# Altium project Motor_Control_Board.PrjPcb
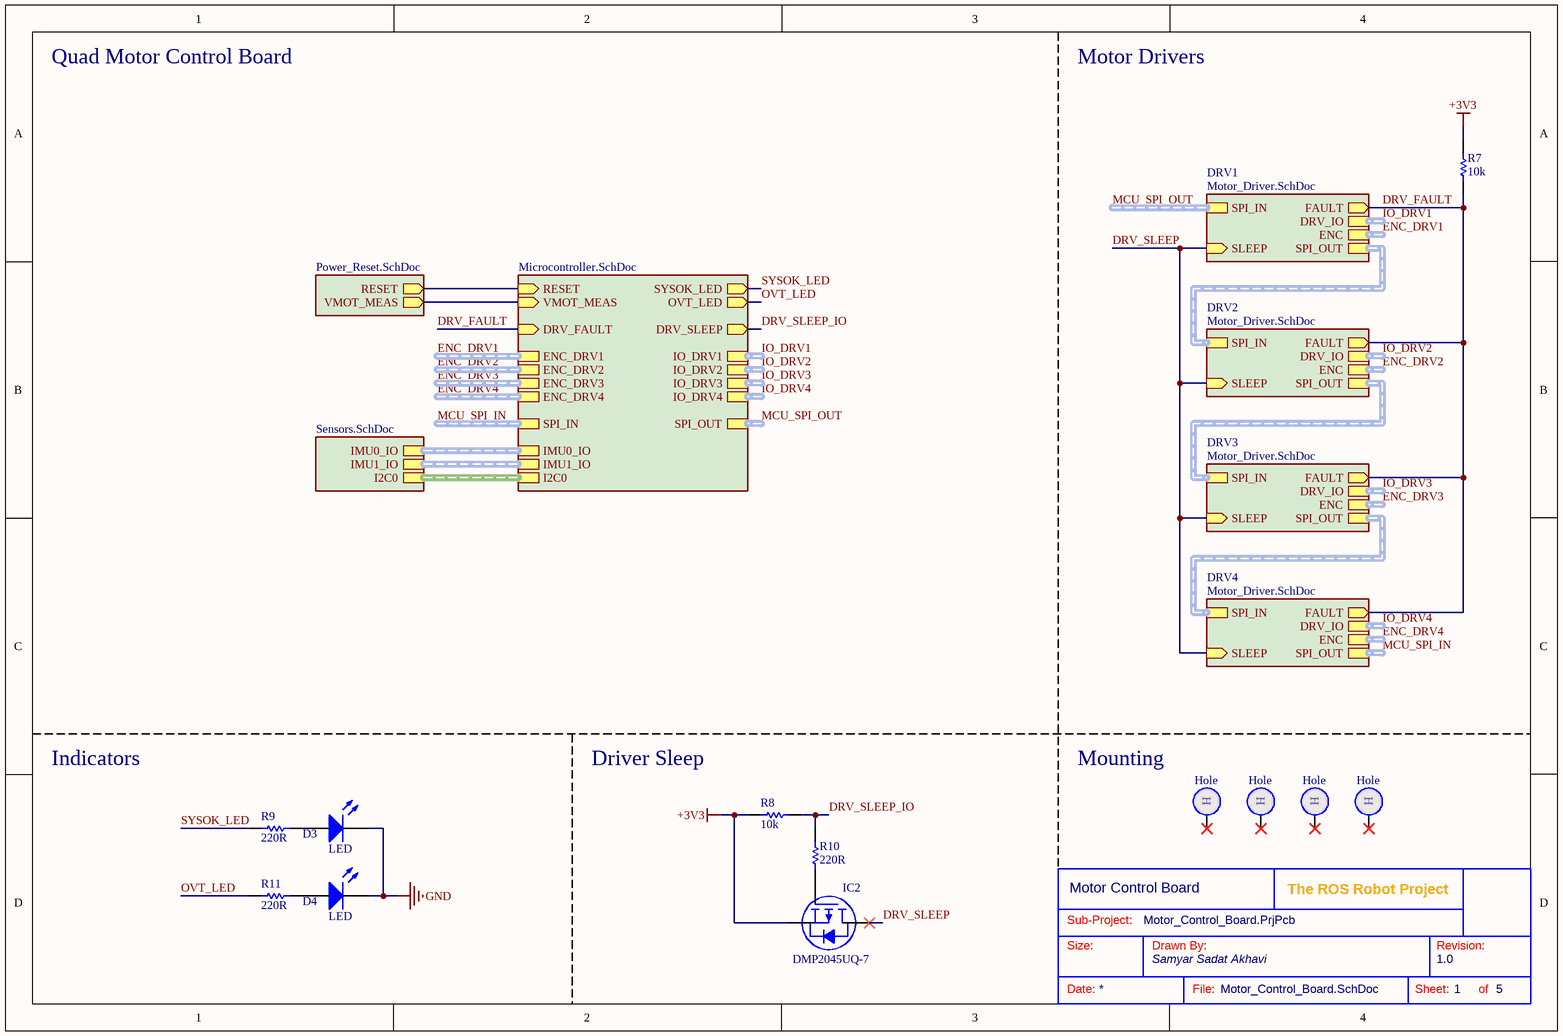
[diagram p0: Motor_Control_Board.SchDoc]
MainProjectName: The ROS Robot Project
4 sheets, 69 parts. Net scope: hierarchical (ports join the sheet entries above them; power ports are global).
Board file: Motor_Control_Board.PcbDoc
Sheets:
  Motor_Control_Board.SchDoc
    MCU = Microcontroller.SchDoc
    PWR = Power_Reset.SchDoc
    SENS = Sensors.SchDoc

## Sheet Motor_Control_Board.SchDoc: Motor Control Board
size A4; DrawnBy: Samyar Sadat Akhavi; Revision: 1.0; SheetNumber: 1; SheetTotal: 5

### Parts
(Parts that share a designator on the sheet are numbered #1, #2 ... from top to bottom, then left to right.)
?#1  (no value)  (graphical)
D3  LED  [LED_1206]
D4  LED  [LED_1206]
Hole1  Hole  [hole_2.6]  (no BOM)
Hole2  Hole  [hole_2.6]  (no BOM)
Hole3  Hole  [hole_2.6]  (no BOM)
Hole4  Hole  [hole_2.6]  (no BOM)
IC2  DMP2045UQ-7  [DIODES SOT-23-3]
R7  10k  [RES_0603]
R8  10k  [RES_0603]
R9  220R  [RES_0603]
R10  220R  [RES_0603]
R11  220R  [RES_0603]

### Sub-sheets
DRV1 = Motor_Driver.SchDoc (file not in this document): DRV_IO (harness Drive_IO), ENC (harness Encoder), SLEEP (in), SPI_IN (harness SPI_Uni), SPI_OUT (harness SPI_Uni), FAULT (out)
DRV2 = Motor_Driver.SchDoc (file not in this document): DRV_IO (harness Drive_IO), ENC (harness Encoder), SLEEP (in), SPI_IN (harness SPI_Uni), SPI_OUT (harness SPI_Uni), FAULT (out)
DRV3 = Motor_Driver.SchDoc (file not in this document): DRV_IO (harness Drive_IO), ENC (harness Encoder), SLEEP (in), SPI_IN (harness SPI_Uni), SPI_OUT (harness SPI_Uni), FAULT (out)
DRV4 = Motor_Driver.SchDoc (file not in this document): DRV_IO (harness Drive_IO), ENC (harness Encoder), SLEEP (in), SPI_IN (harness SPI_Uni), SPI_OUT (harness SPI_Uni), FAULT (out)
MCU = Microcontroller.SchDoc: RESET (in), DRV_SLEEP (out), OVT_LED (out), SYSOK_LED (out), VMOT_MEAS (in), ENC_DRV1 (harness Encoder), IO_DRV1 (harness Drive_IO), SPI_OUT (harness SPI_Uni), SPI_IN (harness SPI_Uni), ENC_DRV2 (harness Encoder), ENC_DRV3 (harness Encoder), ENC_DRV4 (harness Encoder), IO_DRV2 (harness Drive_IO), IO_DRV3 (harness Drive_IO), IO_DRV4 (harness Drive_IO), DRV_FAULT (in), I2C0 (harness I2C), IMU0_IO (harness IMU_IO), IMU1_IO (harness IMU_IO)
PWR = Power_Reset.SchDoc: RESET (out), VMOT_MEAS (out)
SENS = Sensors.SchDoc: I2C0 (harness I2C), IMU0_IO (harness IMU_IO), IMU1_IO (harness IMU_IO)

### Nets
+3V3: IC2.2(S) R7.1 R8.2
GND: D3.2(K) D4.2(K)
DRV_FAULT: R7.2 ; sheet DRV1/FAULT, sheet MCU/DRV_FAULT, sheet DRV2/FAULT, sheet DRV3/FAULT, sheet DRV4/FAULT
DRV_SLEEP: IC2.3(D) ; sheet DRV1/SLEEP, sheet DRV2/SLEEP, sheet DRV3/SLEEP, sheet DRV4/SLEEP
DRV_SLEEP_IO: R8.1 R10.2 ; sheet MCU/DRV_SLEEP
OVT_LED: R11.2 ; sheet MCU/OVT_LED
RESET: sheet MCU/RESET, sheet PWR/RESET
SYSOK_LED: R9.2 ; sheet MCU/SYSOK_LED
VMOT_MEAS: sheet MCU/VMOT_MEAS, sheet PWR/VMOT_MEAS
NetD3_1: D3.1(A) R9.1
NetD4_1: D4.1(A) R11.1
NetIC2_1: IC2.1(G) R10.1

Not connected (* = marked no-connect by the designer): Hole1 1*; Hole2 1*; Hole3 1*; Hole4 1*

### Buses and harness runs
harness ENC_DRV1 = sheet DRV1/ENC
harness ENC_DRV1 = sheet MCU/ENC_DRV1
harness ENC_DRV2 = sheet DRV2/ENC
harness ENC_DRV2 = sheet MCU/ENC_DRV2
harness ENC_DRV3 = sheet DRV3/ENC
harness ENC_DRV3 = sheet MCU/ENC_DRV3
harness ENC_DRV4 = sheet DRV4/ENC
harness ENC_DRV4 = sheet MCU/ENC_DRV4
harness IO_DRV1 = sheet DRV1/DRV_IO
harness IO_DRV1 = sheet MCU/IO_DRV1
harness IO_DRV2 = sheet DRV2/DRV_IO
harness IO_DRV2 = sheet MCU/IO_DRV2
harness IO_DRV3 = sheet DRV3/DRV_IO
harness IO_DRV3 = sheet MCU/IO_DRV3
harness IO_DRV4 = sheet DRV4/DRV_IO
harness IO_DRV4 = sheet MCU/IO_DRV4
harness MCU_SPI_IN = sheet DRV4/SPI_OUT
harness MCU_SPI_IN = sheet MCU/SPI_IN
harness MCU_SPI_OUT = sheet DRV1/SPI_IN
harness MCU_SPI_OUT = sheet MCU/SPI_OUT
harness sheet DRV1/SPI_OUT = sheet DRV2/SPI_IN
harness sheet DRV2/SPI_OUT = sheet DRV3/SPI_IN
harness sheet DRV3/SPI_OUT = sheet DRV4/SPI_IN
harness sheet MCU/I2C0 = sheet SENS/I2C0
harness sheet MCU/IMU0_IO = sheet SENS/IMU0_IO
harness sheet MCU/IMU1_IO = sheet SENS/IMU1_IO

### Notes on the sheet
- Quad Motor Control Board
- Motor Drivers
- Indicators
- Driver Sleep
- Mounting
- Sub-Project:
- Size:
- Drawn By:
- Revision:
- Date:
- File:
- Sheet:
- of
- (in symbol Hole) H

### Library data of the parts
?#1 = Standard Title Block
D3 = LED: Indicator LED; Color: Green
D4 = LED: Indicator LED; Color: Amber
IC2 = DMP2045UQ-7: MOSFET P-CH 20V 4.3A SOT23; Manufacturer: Diodes Incorporated; Current - Continuous Drain (Id) @ 25°C: 4.3A (Ta); Drive Voltage (Max Rds On,  Min Rds On): 1.8V, 4.5V; FET Type: P-Channel; Gate Charge (Qg) (Max) @ Vgs: 6.8 nC @ 4.5 V; Input Capacitance (Ciss) (Max) @ Vds: 634 pF @ 10 V; Power Dissipation (Max): 800mW (Ta); Rds On (Max) @ Id, Vgs: 45mOhm @ 4A, 4.5V; Vgs (Max): ±8V; Vgs(th) (Max) @ Id: 1V @ 250µA; Part Number: DMP2045UQ-7; ComponentLink1Description: Datasheet; ComponentLink1URL: https://www.diodes.com/assets/Datasheets/DMP2045UQ.pdf; ComponentLink2Description: DigiKey Link; ComponentLink2URL: https://www.digikey.com/en/products/detail/diodes-incorporated/DMP2045UQ-7/10674156; Drain to Source Voltage (Vdss): 20 V; LastUpdated: 6/3/2024 8:15:19 PM; Lifecycle Status: Active; Minimum Order: 1; Mounting Type: Surface Mount; Operating Temperature: -55°C ~ 150°C (TJ); Package / Case: TO-236-3, SC-59, SOT-23-3; Packaging: TapeAndReel; Part Status: Active; Price: 0.08; Series: -; Supplier 1: DigiKey; Supplier Part Number 1: 31-DMP2045UQ-7CT-ND; Supplier Device Package: SOT-23-3; Technology: MOSFET (Metal Oxide)
R7-R11 = Resistor: Power: 1/8W
  R7 R8: Value: 10k
  R9-R11: Value: 220R

## Sheet Microcontroller.SchDoc: Microcontroller
size A4; DrawnBy: Samyar Sadat Akhavi; Revision: 1.0; SheetNumber: 3; SheetTotal: 5
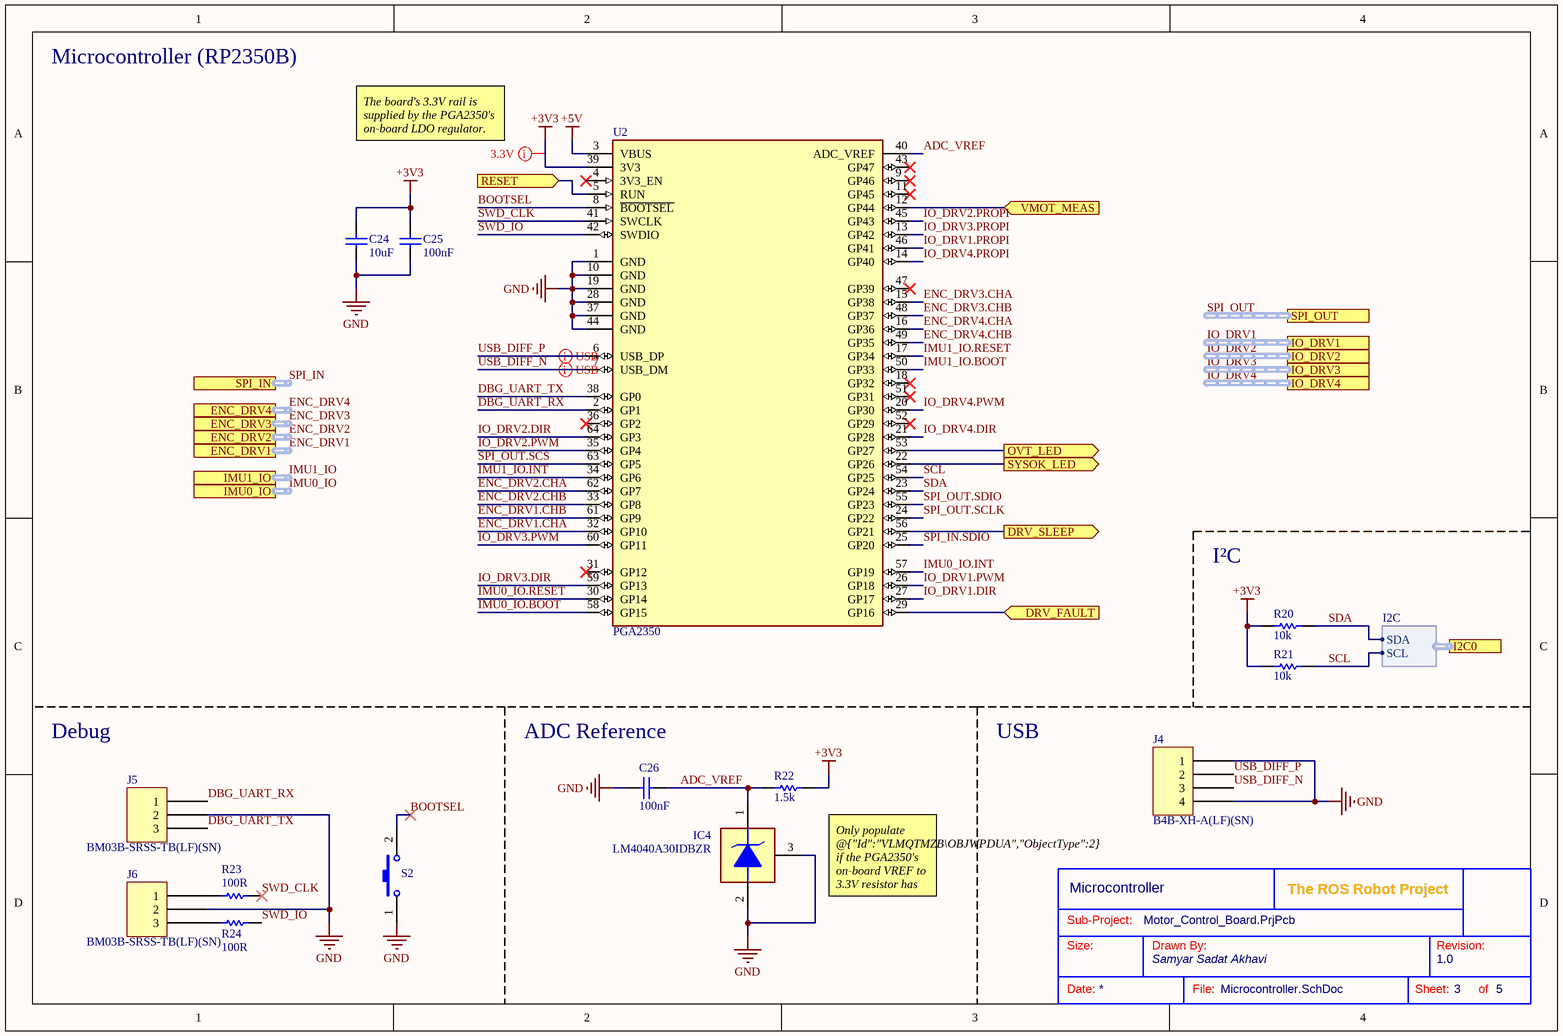
[diagram p1: Microcontroller.SchDoc]

### Parts
(Parts that share a designator on the sheet are numbered #1, #2 ... from top to bottom, then left to right.)
?#2  (no value)  (graphical)
C24  10uF  [CAP_SMD_805]
C25  100nF  [CAP_SMD_603]
C26  100nF  [CAP_SMD_603]
IC4  LM4040A30IDBZR  [SOT95P237X112-3N]
J4  B4B-XH-A(LF)(SN)  [JST XH B4B-XH-A]
J5  BM03B-SRSS-TB(LF)(SN)  [JST BM03B-SRSS-TB]
J6  BM03B-SRSS-TB(LF)(SN)  [JST BM03B-SRSS-TB]
R20  10k  [RES_0603]
R21  10k  [RES_0603]
R22  1.5k  [RES_0603]
R23  100R  [RES_0603]
R24  100R  [RES_0603]
S2  PTS815_SJK_250_SMTR_LFS  [PTS815SJK250SMTRLFS]  (value not drawn)
U2  PGA2350  [PGA2350]

### Ports
DRV_FAULT (in, see Motor_Control_Board[2B]), DRV_SLEEP (out, see Motor_Control_Board[2B]), ENC_DRV1 (harness Encoder, see Motor_Control_Board[2B]), ENC_DRV2 (harness Encoder, see Motor_Control_Board[2B]), ENC_DRV3 (harness Encoder, see Motor_Control_Board[2B]), ENC_DRV4 (harness Encoder, see Motor_Control_Board[2B]), I2C0 (harness I2C, see Motor_Control_Board[2B], Sensors[4D]), IMU0_IO (harness IMU_IO, see Motor_Control_Board[2B], Sensors[2A]), IMU1_IO (harness IMU_IO, see Motor_Control_Board[2B], Sensors[2B]), IO_DRV1 (harness Drive_IO, see Motor_Control_Board[2B]), IO_DRV2 (harness Drive_IO, see Motor_Control_Board[2B]), IO_DRV3 (harness Drive_IO, see Motor_Control_Board[2B]), IO_DRV4 (harness Drive_IO, see Motor_Control_Board[2B]), OVT_LED (out, see Motor_Control_Board[2B]), RESET (in, see Motor_Control_Board[2B], Power_Reset[2A]), SPI_IN (harness SPI_Uni, see Motor_Control_Board[2B]), SPI_OUT (harness SPI_Uni, see Motor_Control_Board[2B]), SYSOK_LED (out, see Motor_Control_Board[2B]), VMOT_MEAS (in, see Motor_Control_Board[2B], Power_Reset[2D])

### Harnesses
I2C: SDA, SCL

### Nets
+3V3: C24.2 C25.2 R20.2 R21.2 R22.2 U2.39(3V3)
+5V: U2.3(VBUS)
GND: C24.1 C25.1 C26.2 IC4.2(A) IC4.3 J4.1 J4.4 J5.2 J6.2 S2.1(COM) U2.1(GND) U2.10(GND) U2.19(GND) U2.28(GND) U2.37(GND) U2.44(GND)
ADC_VREF: C26.1 IC4.1(K) R22.1 U2.40(ADC_VREF)
BOOTSEL: S2.2(NO) U2.8(~{BOOTSEL})
DBG_UART_RX: J5.1 U2.2(GP1)
DBG_UART_TX: J5.3 U2.38(GP0)
DRV_FAULT: U2.29(GP16) ; port DRV_FAULT
DRV_SLEEP_IO: U2.56(GP21) ; port DRV_SLEEP
ENC_DRV1.CHA: U2.32(GP10)
ENC_DRV1.CHB: U2.61(GP9)
ENC_DRV2.CHA: U2.62(GP7)
ENC_DRV2.CHB: U2.33(GP8)
ENC_DRV3.CHA: U2.15(GP38)
ENC_DRV3.CHB: U2.48(GP37)
ENC_DRV4.CHA: U2.16(GP36)
ENC_DRV4.CHB: U2.49(GP35)
IMU0_IO.BOOT: U2.58(GP15)
IMU0_IO.INT: U2.57(GP19)
IMU0_IO.RESET: U2.30(GP14)
IMU1_IO.BOOT: U2.50(GP33)
IMU1_IO.INT: U2.34(GP6)
IMU1_IO.RESET: U2.17(GP34)
IO_DRV1.DIR: U2.27(GP17)
IO_DRV1.PROPI: U2.46(GP41)
IO_DRV1.PWM: U2.26(GP18)
IO_DRV2.DIR: U2.64(GP3)
IO_DRV2.PROPI: U2.45(GP43)
IO_DRV2.PWM: U2.35(GP4)
IO_DRV3.DIR: U2.59(GP13)
IO_DRV3.PROPI: U2.13(GP42)
IO_DRV3.PWM: U2.60(GP11)
IO_DRV4.DIR: U2.21(GP28)
IO_DRV4.PROPI: U2.14(GP40)
IO_DRV4.PWM: U2.20(GP30)
OVT_LED: U2.53(GP27) ; port OVT_LED
RESET: U2.5(RUN) ; port RESET
SCL: R21.1 U2.54(GP25) ; port I2C0.SCL  [project net I2C0.SCL]
SDA: R20.1 U2.23(GP24) ; port I2C0.SDA  [project net I2C0.SDA]
SPI_IN.SDIO: U2.25(GP20)
SPI_OUT.SCLK: U2.24(GP22)
SPI_OUT.SCS: U2.63(GP5)
SPI_OUT.SDIO: U2.55(GP23)
SWD_CLK: R23.1 U2.41(SWCLK)
SWD_IO: R24.1 U2.42(SWDIO)
SYSOK_LED: U2.22(GP26) ; port SYSOK_LED
USB_DIFF_N: J4.3 U2.7(USB_DM)
USB_DIFF_P: J4.2 U2.6(USB_DP)
VMOT_MEAS: U2.12(GP44) ; port VMOT_MEAS
NetJ6_1: J6.1 R23.2
NetJ6_3: J6.3 R24.2

Not connected (* = marked no-connect by the designer): U2 4(3V3_EN)* 9(GP46)* 11(GP45)* 18(GP32)* 31(GP12)* 36(GP2)* 43(GP47)* 47(GP39)* 51(GP31)* 52(GP29)*

### Buses and harness runs
harness ENC_DRV1 = port ENC_DRV1
harness ENC_DRV2 = port ENC_DRV2
harness ENC_DRV3 = port ENC_DRV3
harness ENC_DRV4 = port ENC_DRV4
harness IMU0_IO = port IMU0_IO
harness IMU1_IO = port IMU1_IO
harness IO_DRV1 = port IO_DRV1
harness IO_DRV2 = port IO_DRV2
harness IO_DRV3 = port IO_DRV3
harness IO_DRV4 = port IO_DRV4
harness SPI_IN = port SPI_IN
harness SPI_OUT = port SPI_OUT

### Layout directives
differential pair: USB_DIFF_N, USB_DIFF_P
rule Supply Nets [Voltage = 3.300]; net class POWER: +3V3

### Notes on the sheet
- Microcontroller (RP2350B)
- The board's 3.3V rail is supplied by the PGA2350's on-board LDO regulator.
- I²C
- Debug
- (near C26) ADC Reference
- USB
- Only populate @{"Id":"VLMQTMZB\OBJWPDUA","ObjectType":2} if the PGA2350's on-board VREF to 3.3V resistor has been removed.
- Sub-Project:
- Size:
- Drawn By:
- Revision:
- Date:
- File:
- Sheet:
- of

### Library data of the parts
?#2 = Standard Title Block
C24-C26 = Non-polar Capacitor: Generic Ceramic Capacitor; Voltage: 6.3V
  C24: Value: 10uF
  C25 C26: Value: 100nF
IC4 = LM4040A30IDBZR: Integrated Circuit; Manufacturer_Name: Texas Instruments; Datasheet Link: https://www.ti.com/lit/ds/symlink/lm4040.pdf?ts=1622708080852&ref_url=https%253A%252F%252Fwww.ti.com%252Fsitesearch%252Fdocs%252Funiversalsearch.tsp%253FlangPref%253Den-US%2526searchTerm%253DLM4040A30IDBZR%2526nr%253D15; Height: 1.12mm; Manufacturer_Part_Number: LM4040A30IDBZR; Mouser Part Number: 595-LM4040A30IDBZR; Mouser Price/Stock: https://www.mouser.co.uk/ProductDetail/Texas-Instruments/LM4040A30IDBZR?qs=VBduBm9rCJQGyTICzc6%2FQg%3D%3D; Arrow Part Number: LM4040A30IDBZR; Arrow Price/Stock: https://www.arrow.com/en/products/lm4040a30idbzr/texas-instruments?region=nac
J4 = B4B-XH-A(LF)(SN): CONN HEADER VERT 4POS 2.5MM; Manufacturer: JST Sales America Inc.; Contact Length - Post: 0.134" (3.40mm); Current Rating (Amps): 3A; Material Flammability Rating: UL94 V-0; Number of Positions: 4; Number of Positions Loaded: All; Pitch - Mating: 0.098" (2.50mm); Shrouding: Shrouded - 4 Wall; Style: Board to Cable/Wire; Voltage Rating: 250V; System: Connector; Part Number: B4B-XH-A(LF)(SN); ComponentLink1Description: Datasheet; ComponentLink1URL: http://www.jst-mfg.com/product/pdf/eng/eXH.pdf; ComponentLink2Description: DigiKey Link; ComponentLink2URL: http://digikey.com/product-detail/en/jst-sales-america-inc/B4B-XH-A-LF-SN/455-2249-ND/1651047; Connector Type: Header; Contact Finish - Mating: Tin; Contact Finish - Post: Tin; Contact Material: Brass; Contact Shape: Square; Contact Type: Male Pin; Fastening Type: Detent Lock; Insulation Color: Natural; Insulation Height: 0.276" (7.00mm); Insulation Material: Polyamide (PA66), Nylon 6/6; LastUpdated: 1/12/2020 11:46:34 PM; Lifecycle Status: Active; Minimum Order: 1; Mounting Type: Through Hole; Number of Rows: 1; Operating Temperature: -25°C ~ 85°C; Packaging: Bulk; PartId: 69; Part Status: Active; Price: 0.21; Series: XH; Supplier 1: DigiKey; Supplier Part Number 1: 455-2249-ND; Termination: Press-Fit, Solder
J5 J6 = BM03B-SRSS-TB(LF)(SN): CONN HEADER SMD 3POS 1MM; Manufacturer: JST Sales America Inc.; Current Rating (Amps): 0.7A; Material Flammability Rating: UL94 V-0; Number of Positions: 3; Number of Positions Loaded: All; Pitch - Mating: 0.039" (1.00mm); Shrouding: Shrouded - 4 Wall; Style: Board to Cable/Wire; Voltage Rating: 50V; Part Number: BM03B-SRSS-TB(LF)(SN); ComponentLink1Description: Datasheet; ComponentLink1URL: http://www.jst-mfg.com/product/pdf/eng/eSR.pdf; ComponentLink2Description: DigiKey Link; ComponentLink2URL: http://digikey.com/product-detail/en/jst-sales-america-inc/BM03B-SRSS-TB-LF-SN/455-1789-1-ND/926860; Connector Type: Header; Contact Finish - Mating: Tin; Contact Finish - Post: Tin; Contact Material: Copper Alloy; Contact Shape: Square; Contact Type: Male Pin; Fastening Type: Push-Pull; Features: Solder Retention; Insulation Color: Natural; Insulation Height: 0.167" (4.25mm); Insulation Material: Polyamide (PA), Nylon; LastUpdated: 1/12/2020 10:12:14 PM; Lifecycle Status: Active; Minimum Order: 1; Mounting Type: Surface Mount; Number of Rows: 1; Operating Temperature: -25°C ~ 85°C; Packaging: TapeAndReel; PartId: 14; Part Status: Active; Price: 0.24; Series: SR; Supplier 1: DigiKey; Supplier Part Number 1: 455-1789-1-ND; Termination: Solder
R20-R24 = Resistor: Power: 1/8W
  R20 R21: Value: 10k
  R22: Value: 1.5k
  R23 R24: Value: 100R
S2 = PTS815_SJK_250_SMTR_LFS: Switch; Manufacturer_Name: C & K COMPONENTS; Manufacturer_Part_Number: PTS815 SJK 250 SMTR LFS; Datasheet Link: https://www.mouser.com/datasheet/2/60/pts815-1535658.pdf; Height: 2mm; Mouser Part Number: 611-PTS815SJK250SMTR; Mouser Price/Stock: https://www.mouser.co.uk/ProductDetail/CK/PTS815-SJK-250-SMTR-LFS?qs=ahcBuItHZ3yETpGYMHf%2FgQ%3D%3D; Arrow Part Number: PTS815 SJK 250 SMTR LFS; Arrow Price/Stock: https://www.arrow.com/en/products/pts815-sjk-250-smtr-lfs/ck
U2 = PGA2350: RP2350B carrier module; Manufacturer: Pimoroni Ltd.; Part Number: PGA2350; Supplier 1: DigiKey; Supplier Part Number 1: 1778-PIM722-ND

## Sheet Power_Reset.SchDoc: Power Input & Reset
size A4; DrawnBy: Samyar Sadat Akhavi; Revision: 1.0; SheetNumber: 2; SheetTotal: 5
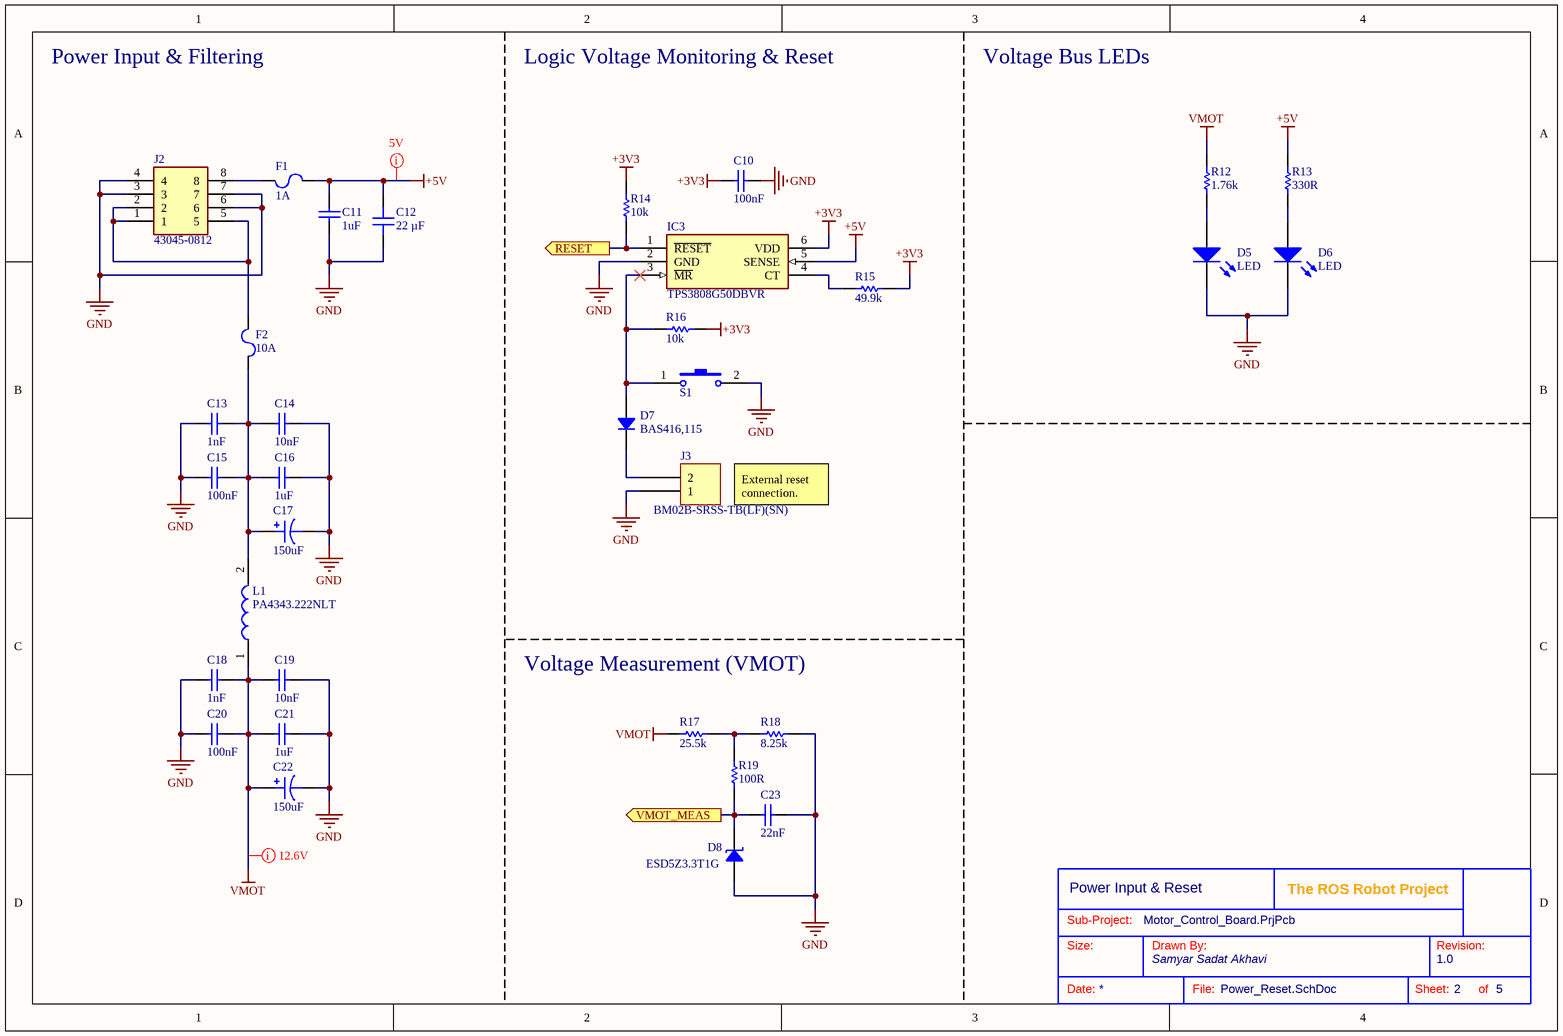
[diagram p2: Power_Reset.SchDoc]

### Parts
(Parts that share a designator on the sheet are numbered #1, #2 ... from top to bottom, then left to right.)
?#3  (no value)  (graphical)
C10  100nF  [CAP_SMD_603]
C11  1uF  [CAP_SMD_805]
C12  22 µF  [CAP 0805_2012]
C13  1nF  [CAP_SMD_603]
C14  10nF  [CAP_SMD_603]
C15  100nF  [CAP_SMD_603]
C16  1uF  [CAP_SMD_805]
C17  150uF  [CAP TH ALUM ELEC D6.30mm S2.50mm H12.50mm]
C18  1nF  [CAP_SMD_603]
C19  10nF  [CAP_SMD_603]
C20  100nF  [CAP_SMD_603]
C21  1uF  [CAP_SMD_805]
C22  150uF  [CAP TH ALUM ELEC D6.30mm S2.50mm H12.50mm]
C23  22nF  [CAP_SMD_603]
D5  LED  [LED_1206]
D6  LED  [LED_1206]
D7  BAS416,115  [SOD323 IPC]
D8  ESD5Z3.3T1G  [SOD523F]
F1  Current Rating (Amps): 1A  [FUSE 1206_3216 0.6MM]  (hidden comment: SF-1206F100-2)
F2  Current Rating (Amps): 10A  [FUSE 1206_3216 0.6MM]  (hidden comment: 3413.0328.22)
IC3  TPS3808G50DBVR  [SOT95P280X145-6N]
J2  43045-0812  [43045-08YY_121314]
J3  BM02B-SRSS-TB(LF)(SN)  [JST BM02B-SRSS-TB]
L1  PA4343.222NLT  [INDPM135125X650N]
R12  1.76k  [RES_0603]
R13  330R  [RES_0603]
R14  10k  [RES_0603]
R15  49.9k  [RES_0603]
R16  10k  [RES_0603]
R17  25.5k  [RES_0603]
R18  8.25k  [RES_0603]
R19  100R  [RES_0603]
S1  PTS815_SJK_250_SMTR_LFS  [PTS815SJK250SMTRLFS]  (value not drawn)

### Ports
RESET (out, see Motor_Control_Board[2B], Microcontroller[2A]), VMOT_MEAS (out, see Motor_Control_Board[2B], Microcontroller[3A])

### Nets
+3V3: C10.2 IC3.6(VDD) R14.2 R15.2 R16.2
+5V: C11.2 C12.2 F1.2 IC3.5(SENSE) R13.1
GND: C10.1 C11.1 C12.1 C13.2 C14.2 C15.2 C16.2 C17.2 C18.2 C19.2 C20.2 C21.2 C22.2 C23.1 D5.2(K) D6.2(K) D8.1 IC3.2(GND) J2.3 J2.4 J2.6 J2.7 J3.1 R18.2 S1.2(NO)
VMOT: C18.1 C19.1 C20.1 C21.1 C22.1 L1.1 R12.1 R17.1
RESET: IC3.1(~{RESET}) R14.1 ; port RESET
VMOT_MEAS: C23.2 D8.2 R19.2 ; port VMOT_MEAS
NetC13_1: C13.1 C14.1 C15.1 C16.1 C17.1 F2.1 L1.2
NetD5_1: D5.1(A) R12.2
NetD6_1: D6.1(A) R13.2
NetD7_1: D7.1 J3.2
NetD7_2: D7.2 IC3.3(~{MR}) R16.1 S1.1(COM)
NetF1_1: F1.1 J2.8
NetF2_2: F2.2 J2.1 J2.2 J2.5
NetIC3_4: IC3.4(CT) R15.1
NetR17_2: R17.2 R18.1 R19.1

### Layout directives
rule Supply Nets [Voltage = 5.000]; net class POWER: +5V
rule Supply Nets [Voltage = 12.60]; net class POWER: VMOT

### Notes on the sheet
- Power Input & Filtering
- Logic Voltage Monitoring & Reset
- Voltage Bus LEDs
- External reset connection.
- Voltage Measurement (VMOT)
- Sub-Project:
- Size:
- Drawn By:
- Revision:
- Date:
- File:
- Sheet:
- of

### Library data of the parts
?#3 = Standard Title Block
C10 C23 = Non-polar Capacitor: Generic Ceramic Capacitor; Voltage: 6.3V
  C10: Value: 100nF
  C23: Value: 22nF
C11 C13-C16 C18-C21 = Non-polar Capacitor: Generic Ceramic Capacitor; Voltage: 16V
  C11 C16 C21: Value: 1uF
  C13 C18: Value: 1nF
  C14 C19: Value: 10nF
  C15 C20: Value: 100nF
C12 = CL21A226MAYNNNE: CAP CER 22UF 25V X5R 0805; manufacturer: Samsung Electro-Mechanics; Tolerance: ±20%; Part Number: CL21A226MAYNNNE; Capacitance: 22 µF; Applications: General Purpose; componentlink1description: Datasheet; componentlink1url: https://media.digikey.com/pdf/Data%20Sheets/Samsung%20PDFs/CL21A226MAYNNNE_Spec.pdf; componentlink2description: DigiKey Link; componentlink2url: https://www.digikey.com/en/products/detail/samsung-electro-mechanics/CL21A226MAYNNNE/10479857; Device Package: 0805 (2012 Metric); lastupdated: 2/9/2024 8:15:02 PM; Lifecycle Status: Active; Minimum Order: 1; Mounting Type: Surface Mount, MLCC; Operating Temperature: -55°C ~ 85°C; Package / Case: 0805 (2012 Metric); packaging: TapeAndReel; partid: 39209; Part Status: Active; price: 0.04; series: CL; Size / Dimension: 0.079" L x 0.049" W (2.00mm x 1.25mm); Supplier 1: DigiKey; Supplier Part Number 1: 1276-CL21A226MAYNNNECT-ND; Temperature Coefficient: X5R; Thickness (Max): 0.057" (1.45mm); value: 22 µF; Voltage - Rated: 25V
C17 C22 = 860020373008: CAP ALUM 150UF 20% 16V RADIAL; manufacturer: Würth Elektronik; Lifetime @ Temp.: 2000 Hrs @ 105°C; Polarization: Polar; Ripple Current @ High Frequency: 234.6mA @ 100kHz; Ripple Current @ Low Frequency: 170mA @ 120Hz; Part Number: 860020373008; Applications: General Purpose; Capacitance: 150uF; componentlink1description: Datasheet; componentlink1url: https://katalog.we-online.de/pbs/datasheet/860020373008.pdf; componentlink2description: DigiKey Link; componentlink2url: http://digikey.com/product-detail/en/w-rth-elektronik/860020373008/732-8795-1-ND/5728740; Device Package: Radial, Can; Height - Seated (Max): 0.492" (12.50mm); lastupdated: 9/4/2020 1:05:50 AM; Lead Spacing: 0.098" (2.50mm); Lifecycle Status: Active; Minimum Order: 1; Mounting Type: Through Hole; Operating Temperature: -40°C ~ 105°C; Package / Case: Radial, Can; packaging: TapeAndBox; partid: 21016; Part Status: Active; price: 0.07; series: WCAP-ATG5; Size / Dimension: 0.248" Dia (6.30mm); Supplier 1: DigiKey; Supplier Part Number 1: 732-8795-1-ND; Tolerance: ±20%; value: 150uF; Voltage - Rated: 16V
D5 D6 = LED: Indicator LED; Color: Blue
D7 = BAS416,115: DIODE STANDARD 75V 200MA SOD323; Manufacturer: Nexperia USA Inc.; Capacitance @ Vr, F: 2pF @ 0V, 1MHz; Current - Reverse Leakage @ Vr: 5 nA @ 75 V; Reverse Recovery Time (trr): 3 µs; Speed: Small Signal =< 200mA (Io), Any Speed; Voltage - Forward (Vf) (Max) @ If: 1.25 V @ 150 mA; Part Number: BAS416,115; ComponentLink1Description: Datasheet; ComponentLink1URL: https://assets.nexperia.com/documents/data-sheet/BAS416.pdf; ComponentLink2Description: DigiKey Link; ComponentLink2URL: https://www.digikey.com/en/products/detail/nexperia-usa-inc/BAS416-115/1232094; Current - Average Rectified (Io): 200mA; Diode Type: Standard; LastUpdated: 10/27/2025 1:55:14 PM; Lifecycle Status: Active; Minimum Order: 1; Mounting Type: Surface Mount; Operating Temperature - Junction: 150°C (Max); Package / Case: SC-76, SOD-323; Packaging: TapeAndReel; PartId: 2951; Part Status: Active; Price: 0.02; Series: -; Supplier 1: DigiKey; Supplier Part Number 1: 1727-4807-1-ND; Supplier Device Package: SOD-323; Voltage - DC Reverse (Vr) (Max): 75 V
D8 = ESD5Z3.3T1G: TVS DIODE 3.3V 14.1V SOD523; Manufacturer: ON Semiconductor; Capacitance @ Frequency: 105pF @ 1MHz; Current - Peak Pulse (10/1000µs): 11.2A (8/20µs); Power Line Protection: No; Power - Peak Pulse: 158W; Type: Zener; Unidirectional Channels: 1; Voltage - Breakdown (Min): 5V; Voltage - Reverse Standoff (Typ): 3.3V (Max); Part Number: ESD5Z3.3T1G; Applications: General Purpose; ComponentLink1Description: Datasheet; ComponentLink1URL: https://www.onsemi.com/pub/Collateral/ESD5Z2.5T1-D.PDF; ComponentLink2Description: DigiKey Link; ComponentLink2URL: http://digikey.com/product-detail/en/on-semiconductor/ESD5Z3.3T1G/ESD5Z3.3T1GOSCT-ND/1967044; LastUpdated: 6/3/2024 8:22:18 PM; Lifecycle Status: Active; Minimum Order: 1; Mounting Type: Surface Mount; Operating Temperature: -55°C ~ 150°C (TJ); Package / Case: SC-79, SOD-523; Packaging: TapeAndReel; PartId: 9754; Part Status: Active; Price: 0.04; Series: -; Supplier 1: DigiKey; Supplier Part Number 1: ESD5Z3.3T1GOSCT-ND; Supplier Device Package: SOD-523; Voltage - Clamping (Max) @ Ipp: 14.1V
F1 = SF-1206F100-2: FUSE BOARD MOUNT 1A 63VDC 1206; Manufacturer: Bourns Inc.; Approval Agency: UL; Breaking Capacity @ Rated Voltage: 50A; Fuse Type: Board Mount (Cartridge Style Excluded); Melting I²t: 0.034; Response Time: Fast Blow; Voltage Rating - DC: 63V; Part Number: SF-1206F100-2; Approvals: UL; ComponentLink1Description: Datasheet; ComponentLink1URL: https://www.bourns.com/pdfs/SF1206F.pdf; ComponentLink2Description: DigiKey Link; ComponentLink2URL: http://digikey.com/product-detail/en/bourns-inc/SF-1206F100-2/SF-1206F100-2CT-ND/1948202; Device Package: 1206 (3216 Metric); LastUpdated: 9/2/2020 1:30:42 AM; Lifecycle Status: Active; Minimum Order: 1; Mounting Type: Surface Mount; Operating Temperature: -40°C ~ 105°C; Package / Case: 1206 (3216 Metric); Packaging: TapeAndReel; Part Status: Active; Price: 0.31; Series: SinglFuse™ SF-1206F; Size / Dimension: 0.122" L x 0.061" W x 0.024" H (3.10mm x 1.55mm x 0.60mm); Supplier 1: DigiKey; Supplier Part Number 1: SF-1206F100-2CT-ND
F2 = 3413.0328.22: FUSE BOARD MOUNT 10A 32VAC 63VDC; Manufacturer: Schurter Inc.; Approval Agency: cURus; Breaking Capacity @ Rated Voltage: 100A; Fuse Type: Board Mount (Cartridge Style Excluded); Melting I²t: 21; Response Time: Slow Blow; Voltage Rating - AC: 32V; Voltage Rating - DC: 63V; Part Number: 3413.0328.22; Approvals: cURus; ComponentLink1Description: Datasheet; ComponentLink1URL: https://us.schurter.com/pdf/english/typ_UST_1206.pdf; ComponentLink2Description: DigiKey Link; ComponentLink2URL: http://digikey.com/product-detail/en/schurter-inc/3413.0328.22/486-1686-1-ND/2870095; Device Package: 1206 (3216 Metric); LastUpdated: 9/2/2020 1:30:41 AM; Lifecycle Status: Active; Minimum Order: 1; Mounting Type: Surface Mount; Operating Temperature: -55°C ~ 90°C; Package / Case: 1206 (3216 Metric); Packaging: TapeAndReel; Part Status: Active; Price: 0.21; Series: UST 1206; Size / Dimension: 0.126" L x 0.063" W x 0.024" H (3.20mm x 1.60mm x 0.60mm); Supplier 1: DigiKey; Supplier Part Number 1: 486-1686-1-ND
IC3 = TPS3808G50DBVR: Integrated Circuit; Manufacturer_Name: Texas Instruments; Datasheet Link: http://www.ti.com/lit/gpn/tps3808; Height: 1.45mm; Manufacturer_Part_Number: TPS3808G50DBVR; Mouser Part Number: 595-TPS3808G50DBVR; Mouser Price/Stock: https://www.mouser.co.uk/ProductDetail/Texas-Instruments/TPS3808G50DBVR?qs=zwk82MlA57bbRDSNjc0z1g%3D%3D; Arrow Part Number: TPS3808G50DBVR; Arrow Price/Stock: https://www.arrow.com/en/products/tps3808g50dbvr/texas-instruments
J2 = 43045-0812: Connector; Manufacturer_Name: Molex; Datasheet Link: https://www.molex.com/pdm_docs/sd/430450612_sd.pdf; Height: 9.91mm; Manufacturer_Part_Number: 43045-0812; Mouser Part Number: 538-43045-0812; Mouser Price/Stock: https://www.mouser.co.uk/ProductDetail/Molex/43045-0812?qs=qjii0NTOo%252B4%252BsykjI9icjA%3D%3D; Arrow Part Number: 43045-0812; Arrow Price/Stock: https://www.arrow.com/en/products/43045-0812/molex?region=nac; System: Connector
J3 = BM02B-SRSS-TB(LF)(SN): CONN HEADER SMD 2POS 1MM; Manufacturer: JST Sales America Inc.; Current Rating (Amps): 0.7A; Material Flammability Rating: UL94 V-0; Number of Positions: 2; Number of Positions Loaded: All; Pitch - Mating: 0.039" (1.00mm); Shrouding: Shrouded - 4 Wall; Style: Board to Cable/Wire; Voltage Rating: 50V; Part Number: BM02B-SRSS-TB(LF)(SN); ComponentLink1Description: Datasheet; ComponentLink1URL: http://www.jst-mfg.com/product/pdf/eng/eSR.pdf; ComponentLink2Description: DigiKey Link; ComponentLink2URL: http://digikey.com/product-detail/en/jst-sales-america-inc/BM02B-SRSS-TB-LF-SN/455-1788-1-ND/926859; Connector Type: Header; Contact Finish - Mating: Tin; Contact Finish - Post: Tin; Contact Material: Copper Alloy; Contact Shape: Square; Contact Type: Male Pin; Fastening Type: Push-Pull; Features: Solder Retention; Insulation Color: Natural; Insulation Height: 0.167" (4.25mm); Insulation Material: Polyamide (PA), Nylon; LastUpdated: 1/12/2020 10:11:04 PM; Lifecycle Status: Active; Minimum Order: 1; Mounting Type: Surface Mount; Number of Rows: 1; Operating Temperature: -25°C ~ 85°C; Packaging: TapeAndReel; PartId: 12; Part Status: Active; Price: 0.22; Series: SR; Supplier 1: DigiKey; Supplier Part Number 1: 455-1788-1-ND; Termination: Solder
L1 = PA4343.222NLT: Inductor; Manufacturer_Name: YAGEO; Datasheet Link: https://productfinder.pulseelectronics.com/api/open/part-attachments/datasheet/PA4343.222NLT; Height: 6.5mm; Manufacturer_Part_Number: PA4343.222NLT; Mouser Part Number: 673-PA4343.222NLT; Mouser Price/Stock: https://www.mouser.co.uk/ProductDetail/Pulse-Electronics/PA4343222NLT?qs=%2FzQKu7YvIMbh7iiJmyUwAg%3D%3D; Arrow Part Number: PA4343.222NLT; Arrow Price/Stock: https://www.arrow.com/en/products/pa4343.222nlt/pulse-electronics-corporation
R12-R19 = Resistor: Power: 1/8W
  R12: Value: 1.76k
  R13: Value: 330R
  R14 R16: Value: 10k
  R15: Value: 49.9k
  R17: Value: 25.5k
  R18: Value: 8.25k
  R19: Value: 100R
S1 = PTS815_SJK_250_SMTR_LFS: as S2 on sheet Microcontroller; Datasheet Link: https://www.mouser.com/datasheet/2/60/pts815-1535658.pdf; Height: 2mm; Mouser Part Number: 611-PTS815SJK250SMTR; Mouser Price/Stock: https://www.mouser.co.uk/ProductDetail/CK/PTS815-SJK-250-SMTR-LFS?qs=ahcBuItHZ3yETpGYMHf%2FgQ%3D%3D; Arrow Part Number: PTS815 SJK 250 SMTR LFS; Arrow Price/Stock: https://www.arrow.com/en/products/pts815-sjk-250-smtr-lfs/ck

## Sheet Sensors.SchDoc: Sensors
size A4; DrawnBy: Samyar Sadat Akhavi; Revision: 1.0; SheetNumber: 5; SheetTotal: 5
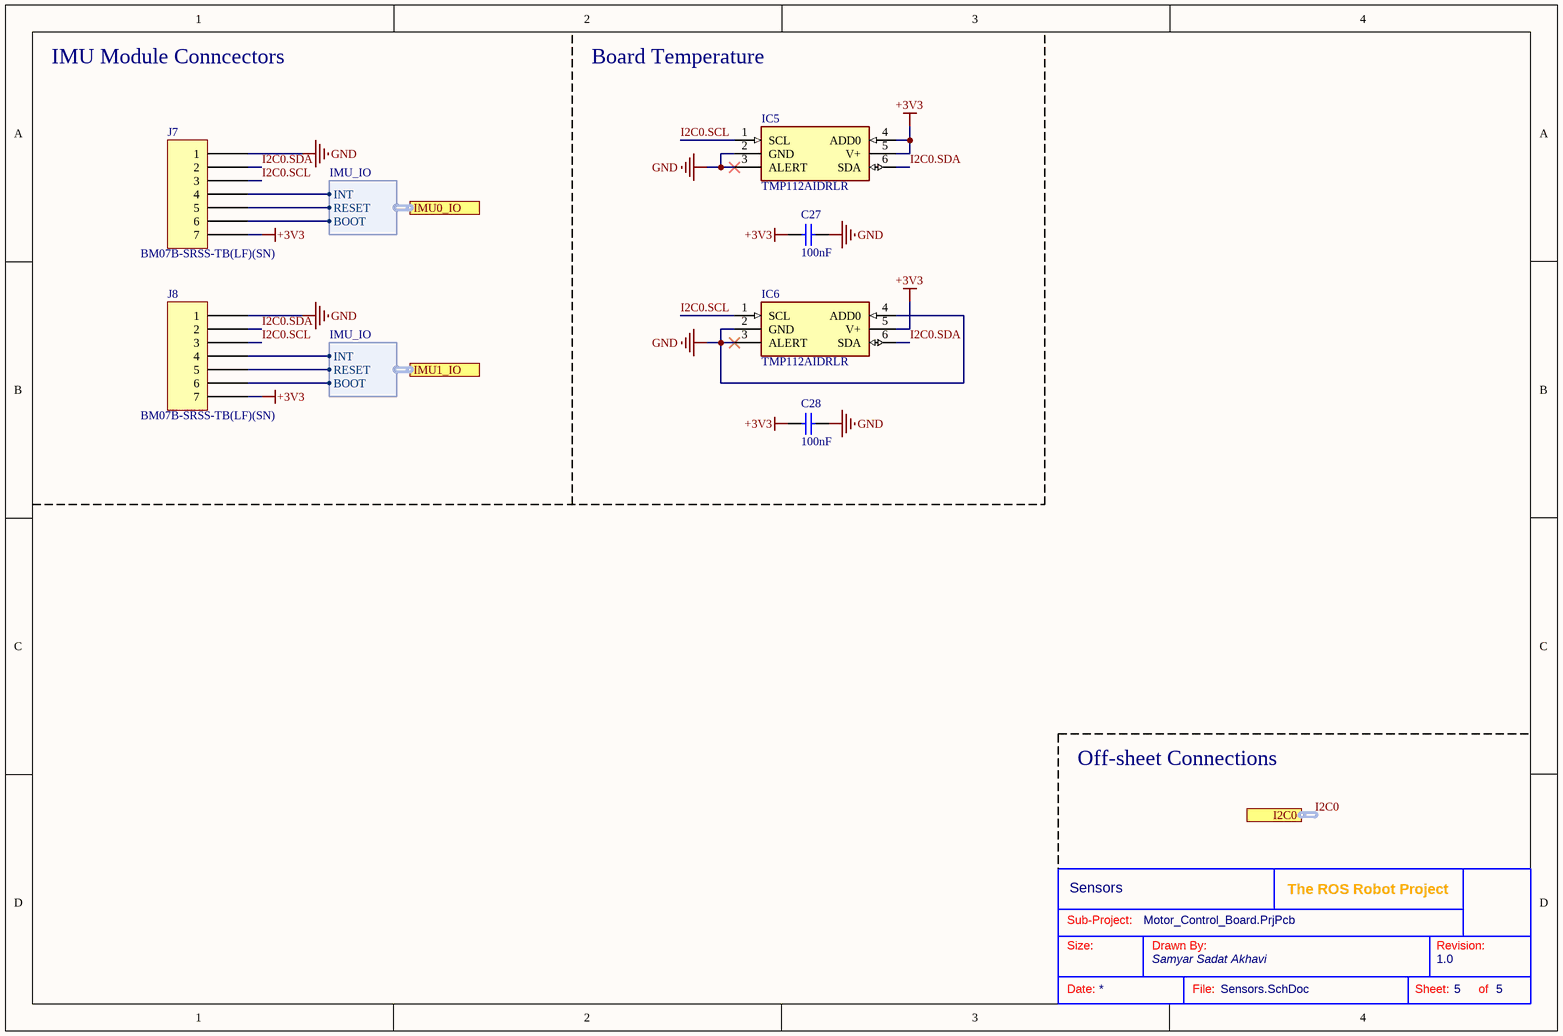
[diagram p3: Sensors.SchDoc]

### Parts
(Parts that share a designator on the sheet are numbered #1, #2 ... from top to bottom, then left to right.)
?#4  (no value)  (graphical)
C27  100nF  [CAP_SMD_603]
C28  100nF  [CAP_SMD_603]
IC5  TMP112AIDRLR  [SOTFL50P160X60-6N]
IC6  TMP112AIDRLR  [SOTFL50P160X60-6N]
J7  BM07B-SRSS-TB(LF)(SN)  [JST BM07B-SRSS-TB]
J8  BM07B-SRSS-TB(LF)(SN)  [JST BM07B-SRSS-TB]

### Ports
I2C0 (harness I2C, see Motor_Control_Board[2B], Microcontroller[4C]), IMU0_IO (harness IMU_IO, see Motor_Control_Board[2B], Microcontroller[1B]), IMU1_IO (harness IMU_IO, see Motor_Control_Board[2B], Microcontroller[1B])

### Harnesses
IMU_IO: INT, RESET, BOOT

### Nets
+3V3: C27.2 C28.2 IC5.4(ADD0) IC5.5(V+) IC6.5(V+) J7.7 J8.7
GND: C27.1 C28.1 IC5.2(GND) IC5.3(ALERT) IC6.2(GND) IC6.3(ALERT) IC6.4(ADD0) J7.1 J8.1
I2C0.SCL: IC5.1(SCL) IC6.1(SCL) J7.3 J8.3
I2C0.SDA: IC5.6(SDA) IC6.6(SDA) J7.2 J8.2
IMU0_IO.BOOT: J7.6 ; port IMU0_IO.BOOT
IMU0_IO.INT: J7.4 ; port IMU0_IO.INT
IMU0_IO.RESET: J7.5 ; port IMU0_IO.RESET
IMU1_IO.BOOT: J8.6 ; port IMU1_IO.BOOT
IMU1_IO.INT: J8.4 ; port IMU1_IO.INT
IMU1_IO.RESET: J8.5 ; port IMU1_IO.RESET

### Buses and harness runs
harness I2C0 = port I2C0

### Notes on the sheet
- IMU Module Conncectors
- Board Temperature
- Off-sheet Connections
- Sub-Project:
- Size:
- Drawn By:
- Revision:
- Date:
- File:
- Sheet:
- of

### Library data of the parts
?#4 = Standard Title Block
C27 C28 = Non-polar Capacitor: Generic Ceramic Capacitor; Voltage: 6.3V; Value: 100nF
IC5 IC6 = TMP112AIDRLR: Integrated Circuit; Manufacturer_Name: Texas Instruments; Datasheet Link: http://www.ti.com/general/docs/suppproductinfo.tsp?distId=10&gotoUrl=http%3A%2F%2Fwww.ti.com%2Flit%2Fgpn%2Ftmp112; Height: 0.6mm; Manufacturer_Part_Number: TMP112AIDRLR; Mouser Part Number: 595-TMP112AIDRLR; Mouser Price/Stock: https://www.mouser.co.uk/ProductDetail/Texas-Instruments/TMP112AIDRLR?qs=62Z1lCHpKYghtK4%2FJn2ysA%3D%3D; Arrow Part Number: TMP112AIDRLR; Arrow Price/Stock: https://www.arrow.com/en/products/tmp112aidrlr/texas-instruments?utm_currency=USD&region=nac
J7 J8 = BM07B-SRSS-TB(LF)(SN): CONN HEADER SMD 7POS 1MM; Manufacturer: JST Sales America Inc.; Current Rating (Amps): 0.7A; Material Flammability Rating: UL94 V-0; Number of Positions: 7; Number of Positions Loaded: All; Pitch - Mating: 0.039" (1.00mm); Shrouding: Shrouded - 4 Wall; Style: Board to Cable/Wire; Voltage Rating: 50V; Part Number: BM07B-SRSS-TB(LF)(SN); ComponentLink1Description: Datasheet; ComponentLink1URL: http://www.jst-mfg.com/product/pdf/eng/eSH.pdf; ComponentLink2Description: DigiKey Link; ComponentLink2URL: http://digikey.com/product-detail/en/jst-sales-america-inc/BM07B-SRSS-TB-LF-SN/455-1793-1-ND/926864; Connector Type: Header; Contact Finish - Mating: Tin; Contact Finish - Post: Tin; Contact Material: Copper Alloy; Contact Shape: Square; Contact Type: Male Pin; Fastening Type: Push-Pull; Features: Solder Retention; Insulation Color: Natural; Insulation Height: 0.167" (4.25mm); Insulation Material: Polyamide (PA), Nylon; LastUpdated: 1/12/2020 10:15:04 PM; Lifecycle Status: Active; Minimum Order: 1; Mounting Type: Surface Mount; Number of Rows: 1; Operating Temperature: -25°C ~ 85°C; Packaging: TapeAndReel; PartId: 22; Part Status: Active; Price: 0.42; Series: SR; Supplier 1: DigiKey; Supplier Part Number 1: 455-1793-1-ND; Termination: Solder

## Nets that join several sheets
+3V3: Motor_Control_Board (IC2.2 R7.1 R8.2), Microcontroller (6 pins), Power_Reset (5 pins), Sensors (7 pins)
+5V: Microcontroller (U2.3), Power_Reset (5 pins)
GND: Motor_Control_Board (D3.2 D4.2), Microcontroller (16 pins), Power_Reset (25 pins), Sensors (9 pins)
DRV_FAULT: Motor_Control_Board (R7.2), Microcontroller (U2.29)
DRV_SLEEP_IO: Motor_Control_Board (R8.1 R10.2), Microcontroller (U2.56)
OVT_LED: Motor_Control_Board (R11.2), Microcontroller (U2.53)
RESET: Microcontroller (U2.5), Power_Reset (IC3.1 R14.1)
SYSOK_LED: Motor_Control_Board (R9.2), Microcontroller (U2.22)
VMOT_MEAS: Microcontroller (U2.12), Power_Reset (C23.2 D8.2 R19.2)